# Altium schematic sheet 06_LMS7002M_2_RF.SchDoc: LMS7002M #2 RF
size A3; Organization: Lime Microsystems; Address1: Surrey Tech Centre; Address2: Guildford GU2 7YG; Address3: Surrey; Address4: United Kingdom; Revision: v1.2; SheetNumber: 6; SheetTotal: 27
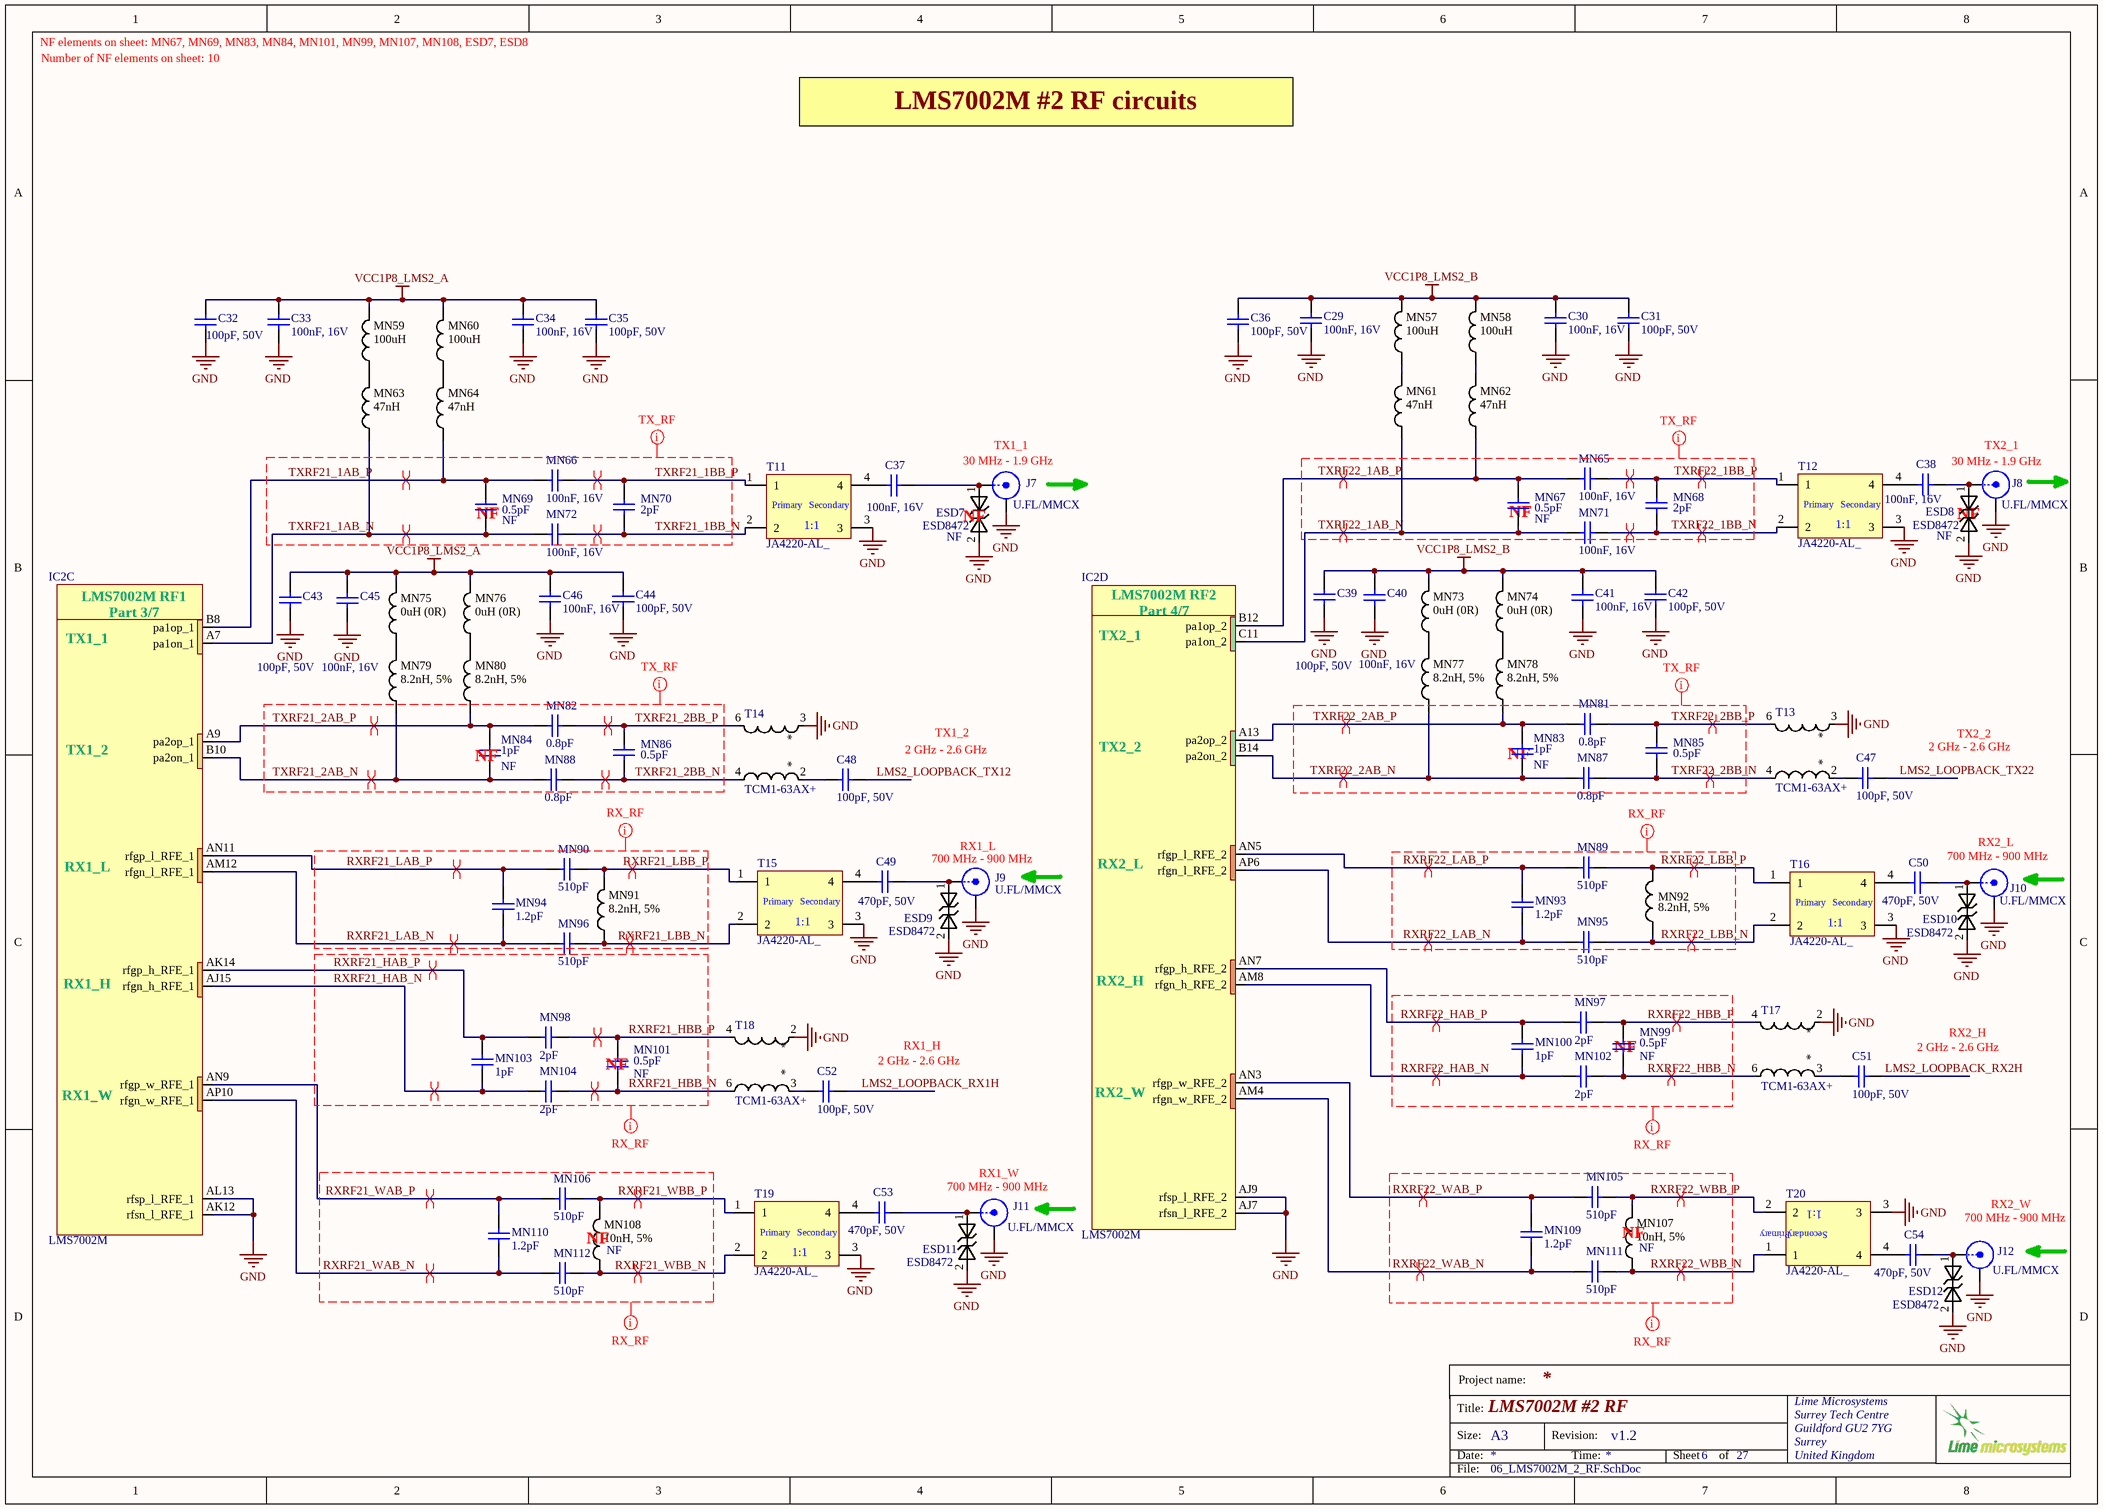
[diagram p0: 06_LMS7002M_2_RF.SchDoc]

## Parts
C29  100nF, 16V  [CAP0402]
C30  100nF, 16V  [CAP0402]
C31  100pF, 50V  [CAP0402]
C32  100pF, 50V  [CAP0402]
C33  100nF, 16V  [CAP0402]
C34  100nF, 16V  [CAP0402]
C35  100pF, 50V  [CAP0402]
C36  100pF, 50V  [CAP0402]
C37  100nF, 16V  [CAP0402]
C38  100nF, 16V  [CAP0402]
C39  100pF, 50V  [CAP0402]
C40  100nF, 16V  [CAP0402]
C41  100nF, 16V  [CAP0402]
C42  100pF, 50V  [CAP0402]
C43  100pF, 50V  [CAP0402]
C44  100pF, 50V  [CAP0402]
C45  100nF, 16V  [CAP0402]
C46  100nF, 16V  [CAP0402]
C47  100pF, 50V  [CAP0402]
C48  100pF, 50V  [CAP0402]
C49  470pF, 50V  [CAP0402]
C50  470pF, 50V  [CAP0402]
C51  100pF, 50V  [CAP0402]
C52  100pF, 50V  [CAP0402]
C53  470pF, 50V  [CAP0402]
C54  470pF, 50V  [CAP0402]
ESD7  ESD8472  Assembly Info: NF  [ESD8472_X3DFN2]
ESD8  ESD8472  Assembly Info: NF  [ESD8472_X3DFN2]
ESD9  ESD8472  [ESD8472_X3DFN2]
ESD10  ESD8472  [ESD8472_X3DFN2]
ESD11  ESD8472  [ESD8472_X3DFN2]
ESD12  ESD8472  [ESD8472_X3DFN2]
IC2  LMS7002M  [LMS7002M_v4]  (parts C,D of 7)
J7  U.FL/MMCX  [MMCX_UFL_conn_u]
J8  U.FL/MMCX  [MMCX_UFL_conn_u]
J9  U.FL/MMCX  [MMCX_UFL_conn_u]
J10  U.FL/MMCX  [MMCX_UFL_conn_u]
J11  U.FL/MMCX  [MMCX_UFL_conn_u]
J12  U.FL/MMCX  [MMCX_UFL_conn_u]
MN57  100uH  [RES0805]
MN58  100uH  [RES0805]
MN59  100uH  [RES0805]
MN60  100uH  [RES0805]
MN61  47nH  [RES0402]
MN62  47nH  [RES0402]
MN63  47nH  [RES0402]
MN64  47nH  [RES0402]
MN65  100nF, 16V  [CAP0402]
MN66  100nF, 16V  [CAP0402]
MN67  0.5pF  Assembly Info: NF  [CAP0402]
MN68  2pF  [CAP0402]
MN69  0.5pF  Assembly Info: NF  [CAP0402]
MN70  2pF  [CAP0402]
MN71  100nF, 16V  [CAP0402]
MN72  100nF, 16V  [CAP0402]
MN73  0uH (0R)  [RES0805]
MN74  0uH (0R)  [RES0805]
MN75  0uH (0R)  [RES0805]
MN76  0uH (0R)  [RES0805]
MN77  8.2nH, 5%  [RES0402]
MN78  8.2nH, 5%  [RES0402]
MN79  8.2nH, 5%  [RES0402]
MN80  8.2nH, 5%  [RES0402]
MN81  0.8pF  [CAP0402]
MN82  0.8pF  [CAP0402]
MN83  1pF  Assembly Info: NF  [CAP0402]
MN84  1pF  Assembly Info: NF  [CAP0402]
MN85  0.5pF  [CAP0402]
MN86  0.5pF  [CAP0402]
MN87  0.8pF  [CAP0402]
MN88  0.8pF  [CAP0402]
MN89  510pF  [CAP0402]
MN90  510pF  [CAP0402]
MN91  8.2nH, 5%  [RES0402]
MN92  8.2nH, 5%  [RES0402]
MN93  1.2pF  [CAP0402]
MN94  1.2pF  [CAP0402]
MN95  510pF  [CAP0402]
MN96  510pF  [CAP0402]
MN97  2pF  [CAP0402]
MN98  2pF  [CAP0402]
MN99  0.5pF  Assembly Info: NF  [CAP0402]
MN100  1pF  [CAP0402]
MN101  0.5pF  Assembly Info: NF  [CAP0402]
MN102  2pF  [CAP0402]
MN103  1pF  [CAP0402]
MN104  2pF  [CAP0402]
MN105  510pF  [CAP0402]
MN106  510pF  [CAP0402]
MN107  10nH, 5%  Assembly Info: NF  [RES0402]
MN108  10nH, 5%  Assembly Info: NF  [RES0402]
MN109  1.2pF  [CAP0402]
MN110  1.2pF  [CAP0402]
MN111  510pF  [CAP0402]
MN112  510pF  [CAP0402]
T11  JA4220-AL_  [JA4220-AL_]
T12  JA4220-AL_  [JA4220-AL_]
T13  TCM1-63AX+  [TCM1-63AX+_v2]
T14  TCM1-63AX+  [TCM1-63AX+_v2]
T15  JA4220-AL_  [JA4220-AL_]
T16  JA4220-AL_  [JA4220-AL_]
T17  TCM1-63AX+  [TCM1-63AX+_v2]
T18  TCM1-63AX+  [TCM1-63AX+_v2]
T19  JA4220-AL_  [JA4220-AL_]
T20  JA4220-AL_  [JA4220-AL_]

## Nets
GND: C29.1 C30.1 C31.2 C32.2 C33.1 C34.1 C35.2 C36.2 C39.2 C40.1 C41.1 C42.2 C43.2 C44.2 C45.1 C46.1 ESD7.2 ESD8.2 ESD9.2 ESD10.2 ESD11.2 ESD12.2 IC2.AJ7(rfsn_l_RFE_2) IC2.AJ9(rfsp_l_RFE_2) IC2.AK12(rfsn_l_RFE_1) IC2.AL13(rfsp_l_RFE_1) J7.2(Y) J8.2(Y) J9.2(Y) J10.2(Y) J11.2(Y) J12.2(Y) T11.3 T12.3 T13.3 T14.3 T15.3 T16.3 T17.2 T18.2 T19.3 T20.3
VCC1P8_LMS2_A: C32.1 C33.2 C34.2 C35.1 C43.1 C44.1 C45.2 C46.2 MN59.2 MN60.2 MN75.2 MN76.2
VCC1P8_LMS2_B: C29.2 C30.2 C31.1 C36.1 C39.1 C40.2 C41.2 C42.1 MN57.2 MN58.2 MN73.2 MN74.2
LMS2_LOOPBACK_RX1H: C52.1
LMS2_LOOPBACK_RX2H: C51.1
LMS2_LOOPBACK_TX12: C48.1
LMS2_LOOPBACK_TX22: C47.1
RXRF21_HAB_N: IC2.AJ15(rfgn_h_RFE_1) MN103.1 MN104.2
RXRF21_HAB_P: IC2.AK14(rfgp_h_RFE_1) MN98.2 MN103.2
RXRF21_HBB_N: MN101.1 MN104.1 T18.6
RXRF21_HBB_P: MN98.1 MN101.2 T18.4
RXRF21_LAB_N: IC2.AM12(rfgn_l_RFE_1) MN94.1 MN96.2
RXRF21_LAB_P: IC2.AN11(rfgp_l_RFE_1) MN90.2 MN94.2
RXRF21_LBB_N: MN91.1 MN96.1 T15.2
RXRF21_LBB_P: MN90.1 MN91.2 T15.1
RXRF21_WAB_N: IC2.AP10(rfgn_w_RFE_1) MN110.2 MN112.2
RXRF21_WAB_P: IC2.AN9(rfgp_w_RFE_1) MN106.2 MN110.1
RXRF21_WBB_N: MN108.1 MN112.1 T19.2
RXRF21_WBB_P: MN106.1 MN108.2 T19.1
RXRF22_HAB_N: IC2.AM8(rfgn_h_RFE_2) MN100.1 MN102.2
RXRF22_HAB_P: IC2.AN7(rfgp_h_RFE_2) MN97.2 MN100.2
RXRF22_HBB_N: MN99.1 MN102.1 T17.6
RXRF22_HBB_P: MN97.1 MN99.2 T17.4
RXRF22_LAB_N: IC2.AP6(rfgn_l_RFE_2) MN93.1 MN95.2
RXRF22_LAB_P: IC2.AN5(rfgp_l_RFE_2) MN89.2 MN93.2
RXRF22_LBB_N: MN92.1 MN95.1 T16.2
RXRF22_LBB_P: MN89.1 MN92.2 T16.1
RXRF22_WAB_N: IC2.AM4(rfgn_w_RFE_2) MN109.2 MN111.2
RXRF22_WAB_P: IC2.AN3(rfgp_w_RFE_2) MN105.2 MN109.1
RXRF22_WBB_N: MN107.1 MN111.1 T20.1
RXRF22_WBB_P: MN105.1 MN107.2 T20.2
TXRF21_1AB_N: IC2.A7(pa1on_1) MN63.1 MN69.1 MN72.1
TXRF21_1AB_P: IC2.B8(pa1op_1) MN64.1 MN66.2 MN69.2
TXRF21_1BB_N: MN70.1 MN72.2 T11.2
TXRF21_1BB_P: MN66.1 MN70.2 T11.1
TXRF21_2AB_N: IC2.B10(pa2on_1) MN79.1 MN84.2 MN88.2
TXRF21_2AB_P: IC2.A9(pa2op_1) MN80.1 MN82.2 MN84.1
TXRF21_2BB_N: MN86.1 MN88.1 T14.4
TXRF21_2BB_P: MN82.1 MN86.2 T14.6
TXRF22_1AB_N: IC2.C11(pa1on_2) MN61.1 MN67.1 MN71.1
TXRF22_1AB_P: IC2.B12(pa1op_2) MN62.1 MN65.2 MN67.2
TXRF22_1BB_N: MN68.1 MN71.2 T12.2
TXRF22_1BB_P: MN65.1 MN68.2 T12.1
TXRF22_2AB_N: IC2.B14(pa2on_2) MN77.1 MN83.2 MN87.2
TXRF22_2AB_P: IC2.A13(pa2op_2) MN78.1 MN81.2 MN83.1
TXRF22_2BB_N: MN85.1 MN87.1 T13.4
TXRF22_2BB_P: MN81.1 MN85.2 T13.6
NetC37_1: C37.1 ESD7.1 J7.1(X)
NetC37_2: C37.2 T11.4
NetC38_1: C38.1 ESD8.1 J8.1(X)
NetC38_2: C38.2 T12.4
NetC47_2: C47.2 T13.2
NetC48_2: C48.2 T14.2
NetC49_1: C49.1 ESD9.1 J9.1(X)
NetC49_2: C49.2 T15.4
NetC50_1: C50.1 ESD10.1 J10.1(X)
NetC50_2: C50.2 T16.4
NetC51_2: C51.2 T17.3
NetC52_2: C52.2 T18.3
NetC53_1: C53.1 ESD11.1 J11.1(X)
NetC53_2: C53.2 T19.4
NetC54_1: C54.1 ESD12.1 J12.1(X)
NetC54_2: C54.2 T20.4
NetMN57_1: MN57.1 MN61.2
NetMN58_1: MN58.1 MN62.2
NetMN59_1: MN59.1 MN63.2
NetMN60_1: MN60.1 MN64.2
NetMN73_1: MN73.1 MN77.2
NetMN74_1: MN74.1 MN78.2
NetMN75_1: MN75.1 MN79.2
NetMN76_1: MN76.1 MN80.2

## Layout directives
differential pair: RXRF21_HAB_N, RXRF21_HAB_P, RXRF21_HBB_N, RXRF21_HBB_P, RXRF21_LAB_N, RXRF21_LAB_P, RXRF21_LBB_N, RXRF21_LBB_P, RXRF21_WAB_N, RXRF21_WAB_P, RXRF21_WBB_N, RXRF21_WBB_P, RXRF22_HAB_N, RXRF22_HAB_P, RXRF22_HBB_N, RXRF22_HBB_P, RXRF22_LAB_N, RXRF22_LAB_P, RXRF22_LBB_N, RXRF22_LBB_P, RXRF22_WAB_N, RXRF22_WAB_P, RXRF22_WBB_N, RXRF22_WBB_P, TXRF21_1AB_N, TXRF21_1AB_P, TXRF21_1BB_N, TXRF21_1BB_P, TXRF21_2AB_N, TXRF21_2AB_P, TXRF21_2BB_N, TXRF21_2BB_P, TXRF22_1AB_N, TXRF22_1AB_P, TXRF22_1BB_N, TXRF22_1BB_P, TXRF22_2AB_N, TXRF22_2AB_P, TXRF22_2BB_N, TXRF22_2BB_P
net class TX_RF: TXRF21_1AB_N, TXRF21_1AB_P, TXRF21_1BB_N, TXRF21_1BB_P, TXRF21_2AB_N, TXRF21_2AB_P, TXRF21_2BB_N, TXRF21_2BB_P, TXRF22_1AB_N, TXRF22_1AB_P, TXRF22_1BB_N, TXRF22_1BB_P, TXRF22_2AB_N, TXRF22_2AB_P, TXRF22_2BB_N, TXRF22_2BB_P
net class RX_RF: RXRF21_HAB_N, RXRF21_HAB_P, RXRF21_HBB_N, RXRF21_HBB_P, RXRF21_LAB_N, RXRF21_LAB_P, RXRF21_LBB_N, RXRF21_LBB_P, RXRF21_WAB_N, RXRF21_WAB_P, RXRF21_WBB_N, RXRF21_WBB_P, RXRF22_HAB_N, RXRF22_HAB_P, RXRF22_HBB_N, RXRF22_HBB_P, RXRF22_LAB_N, RXRF22_LAB_P, RXRF22_LBB_N, RXRF22_LBB_P, RXRF22_WAB_N, RXRF22_WAB_P, RXRF22_WBB_N, RXRF22_WBB_P

## Notes on the sheet
- NF elements on sheet: MN67, MN69, MN83, MN84, MN101, MN99, MN107, MN108, ESD7, ESD8
- Number of NF elements on sheet: 10
- LMS7002M #2 RF circuits
- TX1_1
- TX2_1
- (near MN69) NF
- 30 MHz - 1.9 GHz
- (near MN67) NF
- NF
- (near ESD7) NF
- (near MN84) NF
- 2 GHz - 2.6 GHz
- TX1_2
- (near MN83) NF
- TX2_2
- RX1_L
- RX2_L
- 700 MHz - 900 MHz
- RX1_H
- (near MN99) NF
- (near C51) 2 GHz - 2.6 GHz
- RX2_H
- (near MN101) NF
- (near C52) 2 GHz - 2.6 GHz
- RX1_W
- (near MN108) NF
- (near MN107) NF
- RX2_W
- Project name:
- Title:
- Size:
- Date:
- A3
- Revision:
- Time:
- Sheet
- of
- File:
- (in symbol JA4220-AL_) Primary; Secondary; 1:1
- (in symbol LMS7002Mr3, part C) LMS7002M RF1; Part 3/7; TX1_1; TX1_2; RX1_L; RX1_H; RX1_W
- (in symbol LMS7002Mr3, part D) LMS7002M RF2; Part 4/7; TX2_1; TX2_2; RX2_L; RX2_H; RX2_W

## Library data of the parts
C29 C30 C33 C34 C37 C38 C40 C41 C45 C46 = Cap_0402: Manufacturer: Murata Electronics; Manufacturer Part Number: GRM155R71C104KA88D; Part Description: 0.10µF ±10% 16V Ceramic Capacitor X7R 0402 (1005 Metric); Tolerance: 10 %; Type: General Purpose MLCC; Capacitance: 0.1 uF; Case Length: 1 mm; Dielectric: X7R; Case Height: 0.5 mm; Temperature Coefficient / Code: +/- 15 %; Value: 100nF, 16V; Supplier 1: Mouser; Supplier Part Number 1: 81-GRM155R71C104KA88; Case Code - in: 0402; RoHS: RoHS Compliant; Operating Temperature Range: - 55 C to + 125 C; Series: GRM; Termination Style: SMD/SMT; Package / Case: 0402 (1005 metric); Voltage Rating DC: 16 V; Maximum Operating Temperature: + 125 C; Case Code - mm: 1005; Minimum Operating Temperature: - 55 C; Product Category: Low & Medium Capacitance SMD Ceramic Chip Capacitors; Packaging: Reel; Product: General Type MLCCs; Category: Multilayer Ceramic Capacitors MLCC - SMD/SMT; Brand: Murata Electronics; Case Width: 0.5 mm; RoHS - Mouser: Y; Standard Pack Qty: 10000; Minimum Order Quantity: 1; Reeling: True; Manufacturer Part Number 1: GRM155R71C104KA88D
C31 C32 C35 C36 C39 C42-C44 = Cap_0402: Manufacturer: Yageo; Manufacturer Part Number 1: CC0402JRNPO9BN101; Part Description: 100pF ±5% 50V C0G, NP0 Ceramic Capacitor -55°C ~ 125°C Surface Mount, MLCC 0402 (1005 Metric) 0.039" L x 0.020" W (1.00mm x 0.50mm); Temperature Coefficient: C0G, NP0; Tolerance: ±5%; Value: 100pF, 50V; Supplier 1: Digi-Key; Supplier Part Number 1: 311-1024-1-ND; Category: Capacitors; Features: -; Operating Temperature: -55°C ~ 125°C; Capacitance: 100pF; Thickness (Max): 0.022" (0.55mm); RoHS: RoHS Compliant; Voltage - Rated: 50V; Lead Style: -; Ratings: -; Size / Dimension: 0.039" L x 0.020" W (1.00mm x 0.50mm); Height - Seated (Max): -; Applications: General Purpose; Package / Case: 0402 (1005 Metric); Lead Spacing: -; Packaging: Tape & Reel (TR); Mounting Type: Surface Mount, MLCC
C47 C48 C51 C52 = Cap_0402: Manufacturer Part Number 1: CC0402JRNPO9BN101; Manufacturer: Yageo; Part Description: 100pF ±5% 50V C0G, NP0 Ceramic Capacitor -55°C ~ 125°C Surface Mount, MLCC 0402 (1005 Metric) 0.039" L x 0.020" W (1.00mm x 0.50mm); Tolerance: ±5%; Temperature Coefficient: C0G, NP0; Value: 100pF, 50V; Capacitance: 100pF; Thickness (Max): 0.022" (0.55mm); Size / Dimension: 0.039" L x 0.020" W (1.00mm x 0.50mm); RoHS: RoHS Compliant; Ratings: -; Package / Case: 0402 (1005 Metric); Mounting Type: Surface Mount, MLCC; Height - Seated (Max): -; Features: -; Lead Spacing: -; Voltage - Rated: 50V; Operating Temperature: -55°C ~ 125°C; Packaging: Cut Tape (CT); Applications: General Purpose; Lead Style: -; Supplier 1: Digi-Key; Category: Capacitors; Supplier Part Number 1: 311-1024-1-ND
C49 C50 C53 C54 = Cap_0402: Manufacturer Part Number: C1005C0G1H471J050BA; Manufacturer: TDK Corporation; Part Description: 470pF ±5% 50V Ceramic Capacitor C0G, NP0 0402 (1005 Metric); Tolerance: ±5%; Temperature Coefficient: C0G, NP0; Value: 470pF, 50V; Supplier 1: Digi-Key; Supplier Part Number 1: 445-2656-6-ND; Ratings: -; Package / Case: 0402 (1005 Metric); Capacitance: 470pF; Packaging: Digi-Reel®; RoHS: RoHS Compliant; Lead Style: -; Thickness (Max): 0.022" (0.55mm); Size / Dimension: 0.039" L x 0.020" W (1.00mm x 0.50mm); Lead Spacing: -; Operating Temperature: -55°C ~ 125°C; Height - Seated (Max): -; Applications: General Purpose; Mounting Type: Surface Mount, MLCC; Voltage - Rated: 50V; Category: Capacitors; Features: -
ESD7-ESD12 = ESD8472: Manufacturer: ON Semiconductor; Manufacturer Part Number: ESD8472MUT5G; Part Description: TVS DIODE 5.3VWM 14VC X3DFN2; Voltage - Reverse Standoff (Typ): 5.3V (Max); Voltage - Breakdown (Min): 7V; Voltage - Clamping (Max) @ Ipp: 14V; Current - Peak Pulse (10/1000µs): 3A (8/20µs); Power Line Protection: No; Capacitance @ Frequency: 0.2pF @ 1MHz; Supplier 1: Digi-Key; RoHS: RoHS Compliant; Category: Circuit Protection; Stock 1: 2295; Pricing 1: 1=0.39, 10=0.315, 100=0.2142, 500=0.16068, 1000=0.12051 (USD); Packaging: Cut Tape (CT); Part Status: Active; Type: Zener; Power - Peak Pulse: -; Applications: Automotive, RF Antenna; Operating Temperature: -55°C ~ 150°C (TJ); Mounting Type: Surface Mount; Package / Case: 2-XFDFN; Supplier Device Package: 2-X3DFN (0.62x0.32); ComponentLink1URL: http://www.onsemi.com/pub/Collateral/ESD8472-D.PDF; ComponentLink1Description: http://www.onsemi.com/pub/Collateral/ESD8472-D.PDF; Supplier Part Number 1: ESD8472MUT5GOSCT-ND
IC2 = LMS7002Mr3: Schematic symbol revision 3. Default footprint - 0.31mm pad; Manufacturer: Lime Microsystems; Part Description: IC FPRF Transceiver LMS7002M; 261 pin aQFN; Supplier 1: Lime Microsystems; Supplier Part Number 1: LMS7002M; Manufacturer Part Number 1: LMS7002M
J7-J12 = RF_IF_connector: CONN UMC RCPT STR 50 OHM SMD; Manufacturer: Molex, LLC; Manufacturer Part Number 1: 0734120110; Part Description: Ultra Miniature Coaxial Connector Receptacle, Male Pin 50 Ohm Surface Mount Solder; Body Finish: Nickel; Body Material: Phosphor Bronze; Center Contact Material: Brass; Center Contact Plating: Gold; Connector Style: Ultra Miniature Coaxial; Connector Type: Jack, Male Pin; Contact Termination: Solder; Dielectric Material: Liquid Crystal Polymer (LCP); Frequency - Max: 6GHz; Impedance: 50 Ohm; Voltage Rating: 60V; Cable Group: -; Category: Connectors, Interconnects; Fastening Type: Snap-On; Features: -; Housing Color: Silver; Ingress Protection: -; Mounting Type: Surface Mount; Operating Temperature: -40°C ~ 90°C; Packaging: Cut Tape (CT); RoHS: RoHS Compliant; Shield Termination: Solder; Supplier 1: Digi-Key; Supplier Part Number 1: WM5587CT-ND
MN57-MN60 = Inductor_0603: Manufacturer: TDK Corporation; Manufacturer Part Number: MLF2012C101KT000; Part Description: 100µH Shielded Multilayer Inductor 2mA 3.1 Ohm Max 0805 (2012 Metric); Q @ Freq: 25 @ 1MHz; Shielding: Shielded; Current Rating: 2mA; Frequency - Self Resonant: 7MHz; Frequency - Test: 1MHz; Material - Core: Ferrite; Tolerance: ±10%; Inductance: 100µH; DC Resistance (DCR): 3.1 Ohm Max; Value: 100uH; Supplier 1: Digi-Key; Supplier Part Number 1: 445-1071-1-ND; Supplier Device Package: 0805 (2012 Metric); Size / Dimension: 0.079" L x 0.049" W (2.00mm x 1.25mm); Operating Temperature: -40°C ~ 85°C; Packaging: Cut Tape (CT); RoHS: RoHS Compliant; Current - Saturation: -; Height - Seated (Max): 0.057" (1.45mm); Package / Case: 0805 (2012 Metric); Mounting Type: Surface Mount; Type: Multilayer; Category: Inductors, Coils, Chokes
MN61-MN64 = Inductor_0603: Manufacturer: COILCRAFT; Manufacturer Part Number: 0402HP-47NXJLU; Part Description: COILCRAFT  0402HP-47NXJLU  Surface Mount High Frequency Inductor, 0402HP Series, 47 nH, 420 mA, 0402 [1005 Metric], Wirewound; SVHC: No SVHC (15-Jun-2015); Inductance Tolerance: ± 5%; High Frequency Inductor Case: 0402 [1005 Metric]; Inductor Case Style: 0402 [1005 Metric]<!--FANDB--><div class="features-and-benefits-container"></div>; Inductance: 47; DC Resistance Max: 0.58; Self Resonant Frequency Min: 2.4; Product Range: 0402; DC Current Rating: 420; Inductor Construction: Wirewound; Supplier 1: Farnell; Supplier Part Number 1: 2285856; Packaging: Cut Tape; RoHS: Y-EX; value: 47nH; Manufacturer Part Number 1: 0402HP-47NXJLU
MN65 MN66 MN71 MN72 = Cap_0402: Manufacturer: Murata Electronics; Manufacturer Part Number: GRM155R71C104KA88D; Part Description: 0.10µF ±10% 16V Ceramic Capacitor X7R 0402 (1005 Metric); Tolerance: 10 %; Capacitance: 0.1 uF; Case Length: 1 mm; Dielectric: X7R; Case Height: 0.5 mm; Temperature Coefficient / Code: +/- 15 %; Value: 100nF, 16V; Supplier 1: Mouser; Supplier Part Number 1: 81-GRM155R71C104KA88; Case Code - in: 0402; RoHS: RoHS Compliant; Operating Temperature Range: - 55 C to + 125 C; Series: GRM; Termination Style: SMD/SMT; Package / Case: 0402 (1005 metric); Voltage Rating DC: 16 V; Type: General Purpose MLCC; Maximum Operating Temperature: + 125 C; Case Code - mm: 1005; Minimum Operating Temperature: - 55 C; Product Category: Low & Medium Capacitance SMD Ceramic Chip Capacitors; Packaging: Reel; Product: General Type MLCCs; Category: Multilayer Ceramic Capacitors MLCC - SMD/SMT; Brand: Murata Electronics; Case Width: 0.5 mm; RoHS - Mouser: Y; Standard Pack Qty: 10000; Minimum Order Quantity: 1; Reeling: True; Manufacturer Part Number 1: GRM155R71C104KA88D
MN67 MN69 MN85 MN86 MN99 MN101 = Cap_0402: Manufacturer: Yageo; Manufacturer Part Number 1: CC0402CRNPO9BNR50; Part Description: 0.50pF ±0.25pF 50V Ceramic Capacitor C0G, NP0 0402 (1005 Metric); Capacitance: 0.50pF; Voltage - Rated: 50V; Temperature Coefficient: C0G, NP0; Tolerance: ±0.25pF; Value: 0.5pF; Supplier 1: Digi-Key; Supplier Part Number 1: 311-1001-1-ND; RoHS: RoHS Compliant; Thickness (Max): 0.022" (0.55mm); Features: -; Height - Seated (Max): -; Lead Spacing: -; Applications: General Purpose; Packaging: Cut Tape (CT); Ratings: -; Size / Dimension: 0.039" L x 0.020" W (1.00mm x 0.50mm); Lead Style: -; Mounting Type: Surface Mount, MLCC; Operating Temperature: -55°C ~ 125°C; Package / Case: 0402 (1005 Metric); Category: Capacitors
MN68 MN70 MN97 MN98 MN102 MN104 = Cap_0402: Manufacturer: AVX; Manufacturer Part Number 1: 04025U2R0BAT2A; Part Description: 2pF ±0.1pF 50V Ceramic Capacitor C0G, NP0 0402 (1005 Metric); Product Range: U Series; Voltage Rating: 50; SVHC: No SVHC (17-Dec-2014); Capacitance Tolerance: ± 0.1; Ceramic Capacitor Case: 0402 [1005 Metric]; Capacitance: 2; Dielectric Characteristic: C0G / NP0; Value: 2pF; Supplier 1: Farnell; Supplier Part Number 1: 2332536; Operating Temperature Max: 125; RoHS: YES; Operating Temperature Min: -55; Capacitance Tolerance ±: ± 0.1; Packaging: Cut Tape; MSL: MSL 1 - Unlimited
MN73-MN76 = Inductor_0603: Manufacturer: BOURNS; Manufacturer Part Number 1: CR0805-J/-000ELF; Part Description: RES SMD 0.0 OHM JUMPER 1/8W 0805; Value: 0uH (0R); Supplier 1: Farnell; Supplier Part Number 1: 2008388; RoHS: YES
MN77-MN80 MN91 MN92 = Inductor_0603: Manufacturer: COILCRAFT; Manufacturer Part Number 1: 0402HP-8N2XJLU; Part Description: Surface Mount High Frequency Inductor, 0402HP Series, 8.2 nH, 1.5 A, 0402 [1005 Metric], Wirewound; Inductor Construction: Wirewound; DC Current Rating: 1.5; Inductor Case Style: 0402 [1005 Metric]<!--FANDB--><div class="features-and-benefits-container"></div>; Self Resonant Frequency Min: 5.4; DC Resistance Max: 0.065; High Frequency Inductor Case: 0402 [1005 Metric]; SVHC: No SVHC (16-Jun-2014); Inductance: 8.2; Supplier 1: Farnell; Supplier Part Number 1: 2285826; Packaging: Cut Tape; Product Range: COILCRAFT - 0402; Inductance Tolerance: ± 5%; RoHS: Y-EX; Value: 8.2nH, 5%
MN81 MN82 MN87 MN88 = Cap_0402: Manufacturer: Murata Electronics North America; Manufacturer Part Number 1: GRM1555C1HR80BA01D; Part Description: 0.80pF ±0.1pF 50V Ceramic Capacitor C0G, NP0 0402 (1005 Metric); Temperature Coefficient: C0G, NP0; Capacitance: 0.80pF; Voltage - Rated: 50V; Tolerance: ±0.1pF; Value: 0.8pF; Applications: General Purpose; Operating Temperature: -55°C ~ 125°C; Size / Dimension: 0.039" L x 0.020" W (1.00mm x 0.50mm); Features: -; Supplier 1: Digi-Key; Height - Seated (Max): -; Category: Capacitors; Package / Case: 0402 (1005 Metric); Mounting Type: Surface Mount, MLCC; Lead Spacing: -; Thickness (Max): 0.022" (0.55mm); RoHS: RoHS Compliant; Supplier Part Number 1: 490-6269-1-ND; Packaging: Cut Tape (CT); Ratings: -; Lead Style: -
MN83 MN84 MN100 MN103 = Cap_0402: Manufacturer: TDK Corporation; Manufacturer Part Number 1: C1005C0G1H010B050BA; Part Description: 1pF ±0.1pF 50V Ceramic Capacitor C0G, NP0 0402 (1005 Metric); Voltage - Rated: 50V; Temperature Coefficient: C0G, NP0; Tolerance: ±0.1pF; Value: 1pF; Supplier 1: Digi-Key; Supplier Part Number 1: 445-4854-6-ND; Size / Dimension: 0.039" L x 0.020" W (1.00mm x 0.50mm); Lead Spacing: -; Operating Temperature: -55°C ~ 125°C; Thickness (Max): 0.022" (0.55mm); Package / Case: 0402 (1005 Metric); Features: -; Lead Style: -; Applications: General Purpose; Height - Seated (Max): -; Capacitance: 1pF; RoHS: RoHS Compliant; Mounting Type: Surface Mount, MLCC; Packaging: Digi-Reel®; Ratings: -; Category: Capacitors
MN89 MN90 MN95 MN96 MN105 MN106 MN111 MN112 = Cap_0402: Manufacturer: Murata Electronics North America; Manufacturer Part Number 1: GRM1555C1H511JA01D; Part Description: 510pF ±5% 50V Ceramic Capacitor C0G, NP0 0402 (1005 Metric); Voltage - Rated: 50V; Temperature Coefficient: C0G, NP0; Tolerance: ±5%; Value: 510pF; Supplier 1: Digi-Key; Supplier Part Number 1: 490-3237-1-ND; Height - Seated (Max): -; Features: -; Size / Dimension: 0.039" L x 0.020" W (1.00mm x 0.50mm); Applications: General Purpose; Lead Spacing: -; Package / Case: 0402 (1005 Metric); Ratings: -; Thickness (Max): 0.022" (0.55mm); Lead Style: -; Operating Temperature: -55°C ~ 125°C; Mounting Type: Surface Mount, MLCC; Capacitance: 510pF; Category: Capacitors; RoHS: RoHS Compliant; Packaging: Cut Tape (CT)
MN93 MN94 MN109 MN110 = Cap_0402: Manufacturer: Murata Electronics North America; Manufacturer Part Number 1: GRM1555C1H1R2CA01D; Part Description: 1.2pF ±0.25pF 50V Ceramic Capacitor C0G, NP0 0402 (1005 Metric); Temperature Coefficient: C0G, NP0; Voltage - Rated: 50V; Tolerance: ±0.25pF; Value: 1.2pF; Supplier 1: Digi-Key; Supplier Part Number 1: 490-5927-1-ND; Lead Style: -; Category: Capacitors; Features: -; Packaging: Cut Tape (CT); Operating Temperature: -55°C ~ 125°C; Package / Case: 0402 (1005 Metric); Applications: General Purpose; Size / Dimension: 0.039" L x 0.020" W (1.00mm x 0.50mm); Lead Spacing: -; Ratings: -; Mounting Type: Surface Mount, MLCC; RoHS: RoHS Compliant; Height - Seated (Max): -; Thickness (Max): 0.022" (0.55mm); Capacitance: 1.2pF
MN107 MN108 = Inductor_0603: Manufacturer: COILCRAFT; Part Description: Surface Mount High Frequency Inductor, 0402HP Series, 10 nH, 1.3 A, 0402 [1005 Metric], Wirewound; Manufacturer Part Number 1: 0402HP-10NXJLU; Value: 10nH, 5%; Supplier 1: Farnell; Supplier Part Number 1: 2285830; RoHS: Y-EX
T11 T12 T15 T16 T19 T20 = JA4220-AL_: Part Description: RF balun; 1:1 ratio; 3 dB bandwidth: 0.1 MHz to 3.5 GHz; 3.8mm x 3.8mm; Manufacturer: Coilcraft; Supplier 1: Coilcraft; Supplier Part Number: JA4220-AL_; Supplier Part Number 1: JA4220-AL_
T13 T14 T17 T18 = Balun_v2: Manufacturer: Mini-circuits; Part Description: BALUN WIDE BAND; Manufacturer Part Number 1: TCM1-63AX+; Supplier 1: Mini-circuits; Supplier Part Number 1: TCM1-63AX+